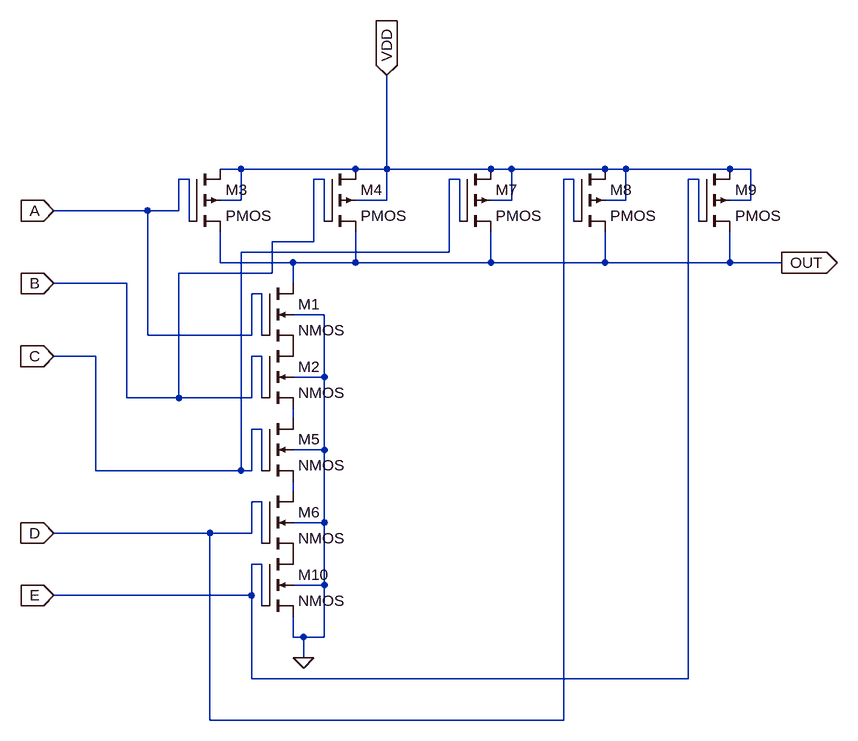
[diagram p0: schematic nand5.asc]
nand5.asc, the LTspice schematic file:
Version 4
SHEET 1 880 788
WIRE -80 -64 -112 -64
WIRE 96 -64 -80 -64
WIRE 144 -64 144 -208
WIRE 144 -64 96 -64
WIRE 304 -64 144 -64
WIRE 336 -64 304 -64
WIRE 480 -64 336 -64
WIRE 512 -64 480 -64
WIRE 672 -64 512 -64
WIRE 704 -64 672 -64
WIRE -160 -48 -176 -48
WIRE 48 -48 32 -48
WIRE 256 -48 240 -48
WIRE 432 -48 416 -48
WIRE 624 -48 608 -48
WIRE -80 -16 -80 -64
WIRE -80 -16 -112 -16
WIRE 144 -16 144 -64
WIRE 144 -16 96 -16
WIRE 336 -16 336 -64
WIRE 336 -16 304 -16
WIRE 512 -16 512 -64
WIRE 512 -16 480 -16
WIRE 704 -16 704 -64
WIRE 704 -16 672 -16
WIRE -224 0 -368 0
WIRE -176 0 -176 -48
WIRE -176 0 -224 0
WIRE -160 16 -160 -48
WIRE 48 16 48 -48
WIRE 256 16 256 -48
WIRE 432 16 432 -48
WIRE 624 16 624 -48
WIRE 32 48 32 -48
WIRE 32 48 -32 48
WIRE 240 64 240 -48
WIRE 240 64 -80 64
WIRE -112 80 -112 32
WIRE 0 80 -112 80
WIRE 96 80 96 32
WIRE 96 80 0 80
WIRE 304 80 304 32
WIRE 304 80 96 80
WIRE 480 80 480 32
WIRE 480 80 304 80
WIRE 672 80 672 32
WIRE 672 80 480 80
WIRE 752 80 672 80
WIRE -32 96 -32 48
WIRE -32 96 -176 96
WIRE -256 112 -368 112
WIRE 0 112 0 80
WIRE -48 128 -64 128
WIRE 48 160 0 160
WIRE -224 192 -224 0
WIRE -64 192 -64 128
WIRE -64 192 -224 192
WIRE -48 192 -48 128
WIRE -304 224 -368 224
WIRE -48 224 -64 224
WIRE 48 256 48 160
WIRE 48 256 0 256
WIRE -256 288 -256 112
WIRE -176 288 -176 96
WIRE -176 288 -256 288
WIRE -64 288 -64 224
WIRE -64 288 -176 288
WIRE -48 288 -48 224
WIRE 0 320 0 304
WIRE -48 336 -64 336
WIRE 48 368 48 256
WIRE 48 368 0 368
WIRE -304 400 -304 224
WIRE -80 400 -80 64
WIRE -80 400 -304 400
WIRE -64 400 -64 336
WIRE -64 400 -80 400
WIRE -48 400 -48 336
WIRE 0 432 0 416
WIRE -48 448 -64 448
WIRE 48 480 48 368
WIRE 48 480 0 480
WIRE -128 496 -368 496
WIRE -64 496 -64 448
WIRE -64 496 -128 496
WIRE -48 512 -48 448
WIRE -48 544 -64 544
WIRE 48 576 48 480
WIRE 48 576 0 576
WIRE -64 592 -64 544
WIRE -64 592 -368 592
WIRE -48 608 -48 544
WIRE 0 656 0 624
WIRE 16 656 0 656
WIRE 48 656 48 576
WIRE 48 656 16 656
WIRE 16 688 16 656
WIRE -64 720 -64 592
WIRE 608 720 608 -48
WIRE 608 720 -64 720
WIRE -128 784 -128 496
WIRE 416 784 416 -48
WIRE 416 784 -128 784
FLAG -368 0 A
IOPIN -368 0 In
FLAG -368 112 B
IOPIN -368 112 In
FLAG -368 224 C
IOPIN -368 224 In
FLAG -368 496 D
IOPIN -368 496 In
FLAG 144 -208 VDD
IOPIN 144 -208 In
FLAG 752 80 OUT
IOPIN 752 80 Out
FLAG 16 688 0
FLAG -368 592 E
IOPIN -368 592 In
SYMBOL nmos4 -48 112 R0
SYMATTR InstName M1
SYMATTR Value2 l=90n w=200n
SYMBOL nmos4 -48 208 R0
SYMATTR InstName M2
SYMATTR Value2 l=90n w=200n
SYMBOL pmos4 -160 -64 R0
SYMATTR InstName M3
SYMATTR Value2 l=90n w=400n
SYMBOL pmos4 48 -64 R0
SYMATTR InstName M4
SYMATTR Value2 l=90n w=400n
SYMBOL nmos4 -48 320 R0
SYMATTR InstName M5
SYMATTR Value2 l=90n w=200n
SYMBOL nmos4 -48 432 R0
SYMATTR InstName M6
SYMATTR Value2 l=90n w=200n
SYMBOL pmos4 256 -64 R0
SYMATTR InstName M7
SYMATTR Value2 l=90n w=400n
SYMBOL pmos4 432 -64 R0
SYMATTR InstName M8
SYMATTR Value2 l=90n w=400n
SYMBOL pmos4 624 -64 R0
SYMATTR InstName M9
SYMATTR Value2 l=90n w=400n
SYMBOL nmos4 -48 528 R0
SYMATTR InstName M10
SYMATTR Value2 l=90n w=200n

The netlist it stands for:
* nand5.asc
M1 OUT A P001 0 NMOS l=90n w=200n
M2 P001 B N001 0 NMOS l=90n w=200n
M3 VDD A OUT VDD PMOS l=90n w=400n
M4 VDD B OUT VDD PMOS l=90n w=400n
M5 N001 C N002 0 NMOS l=90n w=200n
M6 N002 D P002 0 NMOS l=90n w=200n
M7 VDD C OUT VDD PMOS l=90n w=400n
M8 VDD D OUT VDD PMOS l=90n w=400n
M9 VDD E OUT VDD PMOS l=90n w=400n
M10 P002 E 0 0 NMOS l=90n w=200n
.model NMOS NMOS
.model PMOS PMOS
.lib standard.mos
.backanno
.end